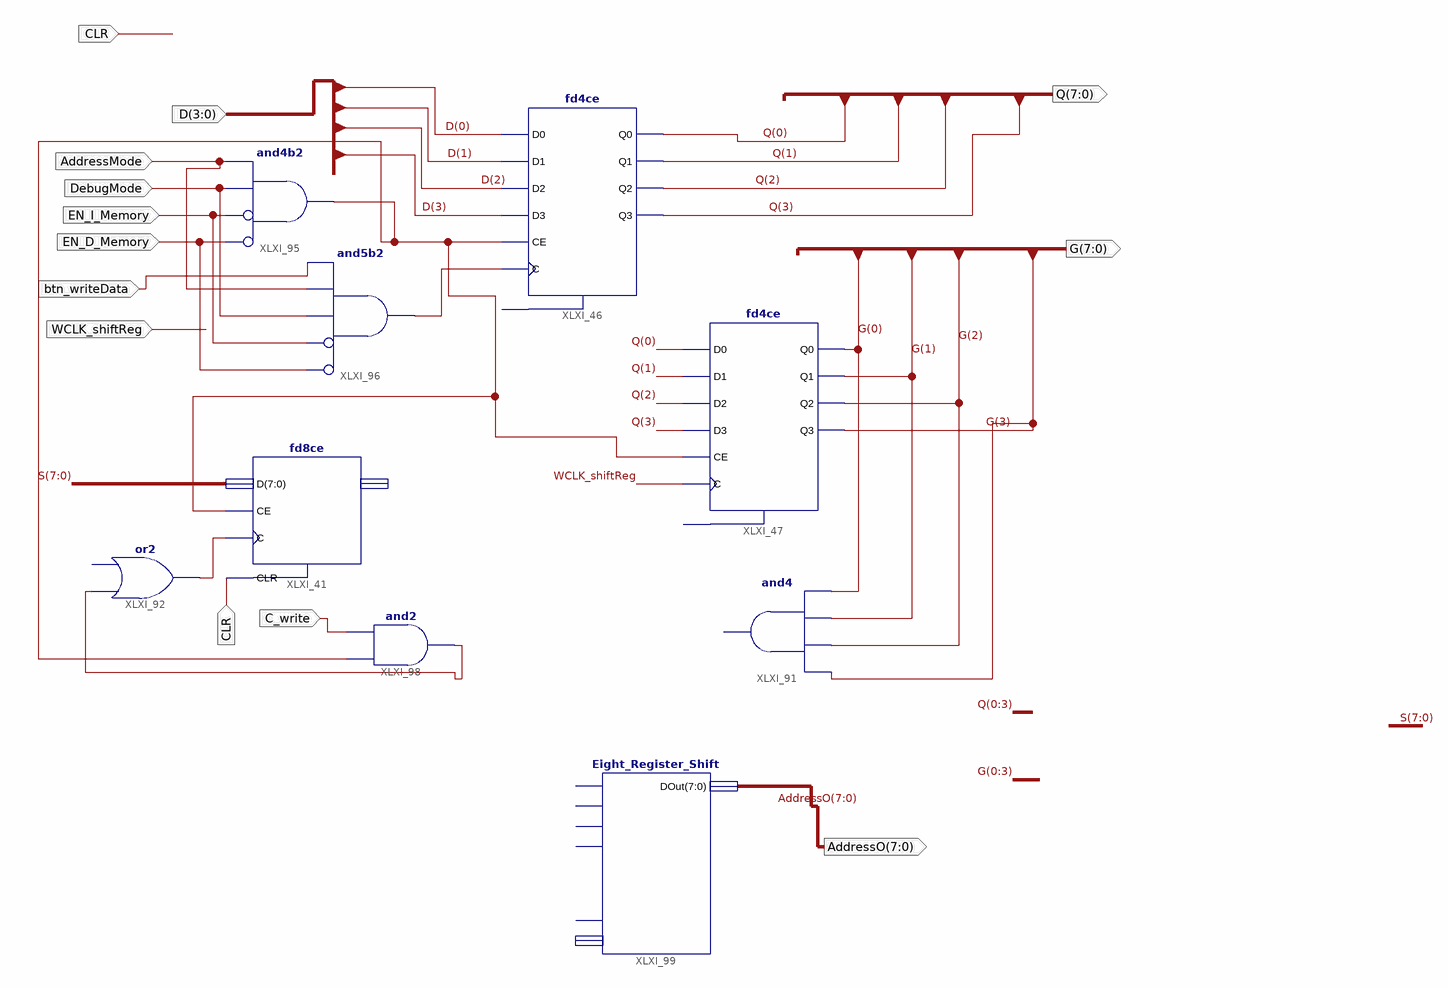
[diagram p0: schematic sheet 1]
// Xilinx ISE schematic Address.sch (spartan3e) as structural Verilog: 9 symbols, 12 ports
module Address (
  input  [3:0] D,
  input  CLR,
  input  WCLK_shiftReg,
  input  AddressMode,
  input  DebugMode,
  input  EN_D_Memory,
  input  EN_I_Memory,
  input  btn_writeData,
  input  C_write,
  output [7:0] Q,
  output [7:0] G,
  output [7:0] AddressO
);

  wire XLXN_351, XLXN_369, XLXN_374, XLXN_376;
  wire [7:0] S;

  fd4ce XLXI_46 (
    .C(XLXN_369), .CE(XLXN_374), .D0(D[0]), .D1(D[1]), .D2(D[2]), .D3(D[3]), .Q0(Q[0]), .Q1(Q[1]), .Q2(Q[2]),
    .Q3(Q[3]));  // open: CLR
  fd4ce XLXI_47 (
    .C(WCLK_shiftReg), .CE(XLXN_374), .D0(Q[0]), .D1(Q[1]), .D2(Q[2]), .D3(Q[3]), .Q0(G[0]), .Q1(G[1]),
    .Q2(G[2]), .Q3(G[3]));  // open: CLR
  fd8ce XLXI_41 (.C(XLXN_351), .CE(XLXN_374), .CLR(CLR), .D(S));  // open: Q
  // and4 XLXI_91 has open pins: I0=G[0], I1=G[1], I2=G[2], I3=G[3], O=open
  and XLXI_95 (XLXN_374, ~EN_D_Memory, ~EN_I_Memory, DebugMode, AddressMode);  // and4b2
  and XLXI_96 (XLXN_369, ~EN_D_Memory, ~EN_I_Memory, DebugMode, AddressMode, btn_writeData);  // and5b2
  and XLXI_98 (XLXN_376, XLXN_374, C_write);
  buf XLXI_92 (XLXN_351, XLXN_376);  // or2 open: I1
  Eight_Register_Shift XLXI_99 (.DOut(AddressO));  // open: WCLK_Shift, C_CE, WCLK_R1, CLR, WCLK_Final, binO
endmodule
